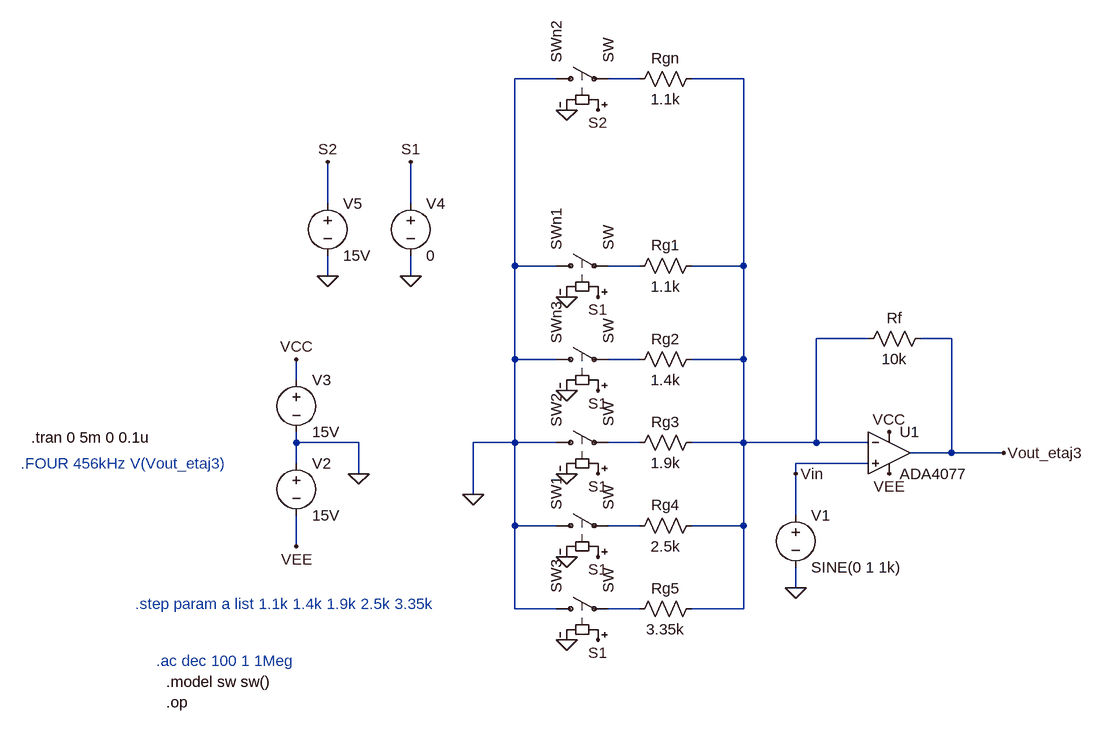
[diagram p0: schematic PGA RG paralel.asc]
PGA RG paralel.asc, the LTspice schematic file:
Version 4
SHEET 1 1176 784
WIRE 352 -256 288 -256
WIRE 480 -256 432 -256
WIRE 640 -256 560 -256
WIRE 0 -64 0 -128
WIRE 128 -64 128 -128
WIRE 288 32 288 -256
WIRE 352 32 288 32
WIRE 480 32 432 32
WIRE 640 32 640 -256
WIRE 640 32 560 32
WIRE 0 48 0 16
WIRE 128 48 128 16
WIRE 832 144 752 144
WIRE 960 144 912 144
WIRE 288 176 288 32
WIRE 352 176 288 176
WIRE 480 176 432 176
WIRE 640 176 640 32
WIRE 640 176 560 176
WIRE -48 208 -48 176
WIRE -48 304 -48 288
WIRE 48 304 -48 304
WIRE 288 304 288 176
WIRE 288 304 224 304
WIRE 352 304 288 304
WIRE 480 304 432 304
WIRE 640 304 640 176
WIRE 640 304 560 304
WIRE 752 304 752 144
WIRE 752 304 640 304
WIRE 832 304 752 304
WIRE 960 320 960 144
WIRE 960 320 896 320
WIRE 1040 320 960 320
WIRE -48 336 -48 304
WIRE 832 336 720 336
WIRE 48 352 48 304
WIRE 720 352 720 336
WIRE 224 384 224 304
WIRE 720 416 720 352
WIRE 288 432 288 304
WIRE 352 432 288 432
WIRE 480 432 432 432
WIRE 640 432 640 304
WIRE 640 432 560 432
WIRE -48 464 -48 416
WIRE 720 528 720 496
WIRE 288 560 288 432
WIRE 352 560 288 560
WIRE 480 560 432 560
WIRE 640 560 640 432
WIRE 640 560 560 560
FLAG 864 288 VCC
FLAG 864 352 VEE
FLAG 224 384 0
FLAG 720 528 0
FLAG 1040 320 Vout_etaj3
FLAG 48 352 0
FLAG -48 176 VCC
FLAG -48 464 VEE
FLAG 368 352 0
FLAG 368 480 0
FLAG 416 352 S1
FLAG 416 480 S1
FLAG 128 48 0
FLAG 128 -128 S1
FLAG 720 352 Vin
FLAG 0 48 0
FLAG 0 -128 S2
FLAG 368 80 0
FLAG 416 80 S1
FLAG 368 -208 0
FLAG 416 -208 S2
FLAG 368 608 0
FLAG 416 608 S1
FLAG 368 224 0
FLAG 416 224 S1
SYMBOL Opamps/ADA4077 864 256 R0
SYMATTR InstName U1
SYMBOL Res 928 128 R90
WINDOW 0 0 56 VBottom 2
WINDOW 3 32 56 VTop 2
SYMATTR InstName Rf
SYMATTR Value 10k
SYMBOL Res 576 288 R90
WINDOW 0 0 56 VBottom 2
WINDOW 3 32 56 VTop 2
SYMATTR InstName Rg3
SYMATTR Value 1.9k
SYMBOL Res 576 416 R90
WINDOW 0 0 56 VBottom 2
WINDOW 3 32 56 VTop 2
SYMATTR InstName Rg4
SYMATTR Value 2.5k
SYMBOL sw 336 304 R270
SYMATTR InstName SW2
SYMBOL sw 336 432 R270
SYMATTR InstName SW1
SYMBOL Voltage 720 400 R0
SYMATTR InstName V1
SYMATTR Value SINE(0 1 1k)
SYMATTR Value2 AC 1
SYMBOL Voltage -48 320 R0
SYMATTR InstName V2
SYMATTR Value 15V
SYMBOL Voltage -48 192 R0
SYMATTR InstName V3
SYMATTR Value 15V
SYMBOL voltage 128 -80 R0
WINDOW 123 0 0 Left 2
WINDOW 39 0 0 Left 2
SYMATTR InstName V4
SYMATTR Value 0
SYMBOL voltage 0 -80 R0
WINDOW 123 0 0 Left 2
WINDOW 39 0 0 Left 2
SYMATTR InstName V5
SYMATTR Value 15V
SYMBOL Res 576 16 R90
WINDOW 0 0 56 VBottom 2
WINDOW 3 32 56 VTop 2
SYMATTR InstName Rg1
SYMATTR Value 1.1k
SYMBOL sw 336 32 R270
SYMATTR InstName SWn1
SYMBOL Res 576 -272 R90
WINDOW 0 0 56 VBottom 2
WINDOW 3 32 56 VTop 2
SYMATTR InstName Rgn
SYMATTR Value 1.1k
SYMBOL sw 336 -256 R270
SYMATTR InstName SWn2
SYMBOL Res 576 544 R90
WINDOW 0 0 56 VBottom 2
WINDOW 3 32 56 VTop 2
SYMATTR InstName Rg5
SYMATTR Value 3.35k
SYMBOL sw 336 560 R270
SYMATTR InstName SW3
SYMBOL Res 576 160 R90
WINDOW 0 0 56 VBottom 2
WINDOW 3 32 56 VTop 2
SYMATTR InstName Rg2
SYMATTR Value 1.4k
SYMBOL sw 336 176 R270
SYMATTR InstName SWn3
TEXT -264 640 Left 2 ;.ac dec 100 1 1Meg
TEXT -248 672 Left 2 !.model sw sw()
TEXT -296 552 Left 2 ;.step param a list 1.1k 1.4k 1.9k 2.5k 3.35k
TEXT -248 704 Left 2 !.op
TEXT -472 336 Left 2 ;.FOUR 456kHz V(Vout_etaj3)
TEXT -456 296 Left 2 !.tran 0 5m 0 0.1u

The netlist it stands for:
* PGA RG paralel.asc
XU1 Vin N002 VCC VEE Vout_etaj3 ADA4077  ; pins In+ In- V+ V- OUT
Rf Vout_etaj3 N002 10k
Rg3 N002 N005 1.9k
Rg4 N002 N006 2.5k
SW2 0 N005 S1 0 SW
SW1 0 N006 S1 0 SW
V1 Vin 0 SINE(0 1 1k) AC 1
V2 0 VEE 15V
V3 VCC 0 15V
V4 S1 0 0
V5 S2 0 15V
Rg1 N002 N003 1.1k
SWn1 0 N003 S1 0 SW
Rgn N002 N001 1.1k
SWn2 0 N001 S2 0 SW
Rg5 N002 N007 3.35k
SW3 0 N007 S1 0 SW
Rg2 N002 N004 1.4k
SWn3 0 N004 S1 0 SW
* .ac dec 100 1 1Meg
.model sw sw()
* .step param a list 1.1k 1.4k 1.9k 2.5k 3.35k
.op
* .FOUR 456kHz V(Vout_etaj3)
.tran 0 5m 0 0.1u
.backanno
.end